# Altium schematic sheet Regulator.SchDoc
size 381 x 203 mm; SheetNumber: 2; SheetTotal: 2; SPICEModelCacheNBKOHBQZ: <root> / <DocumentId>NBKOHBQZ</DocumentId> / </root>
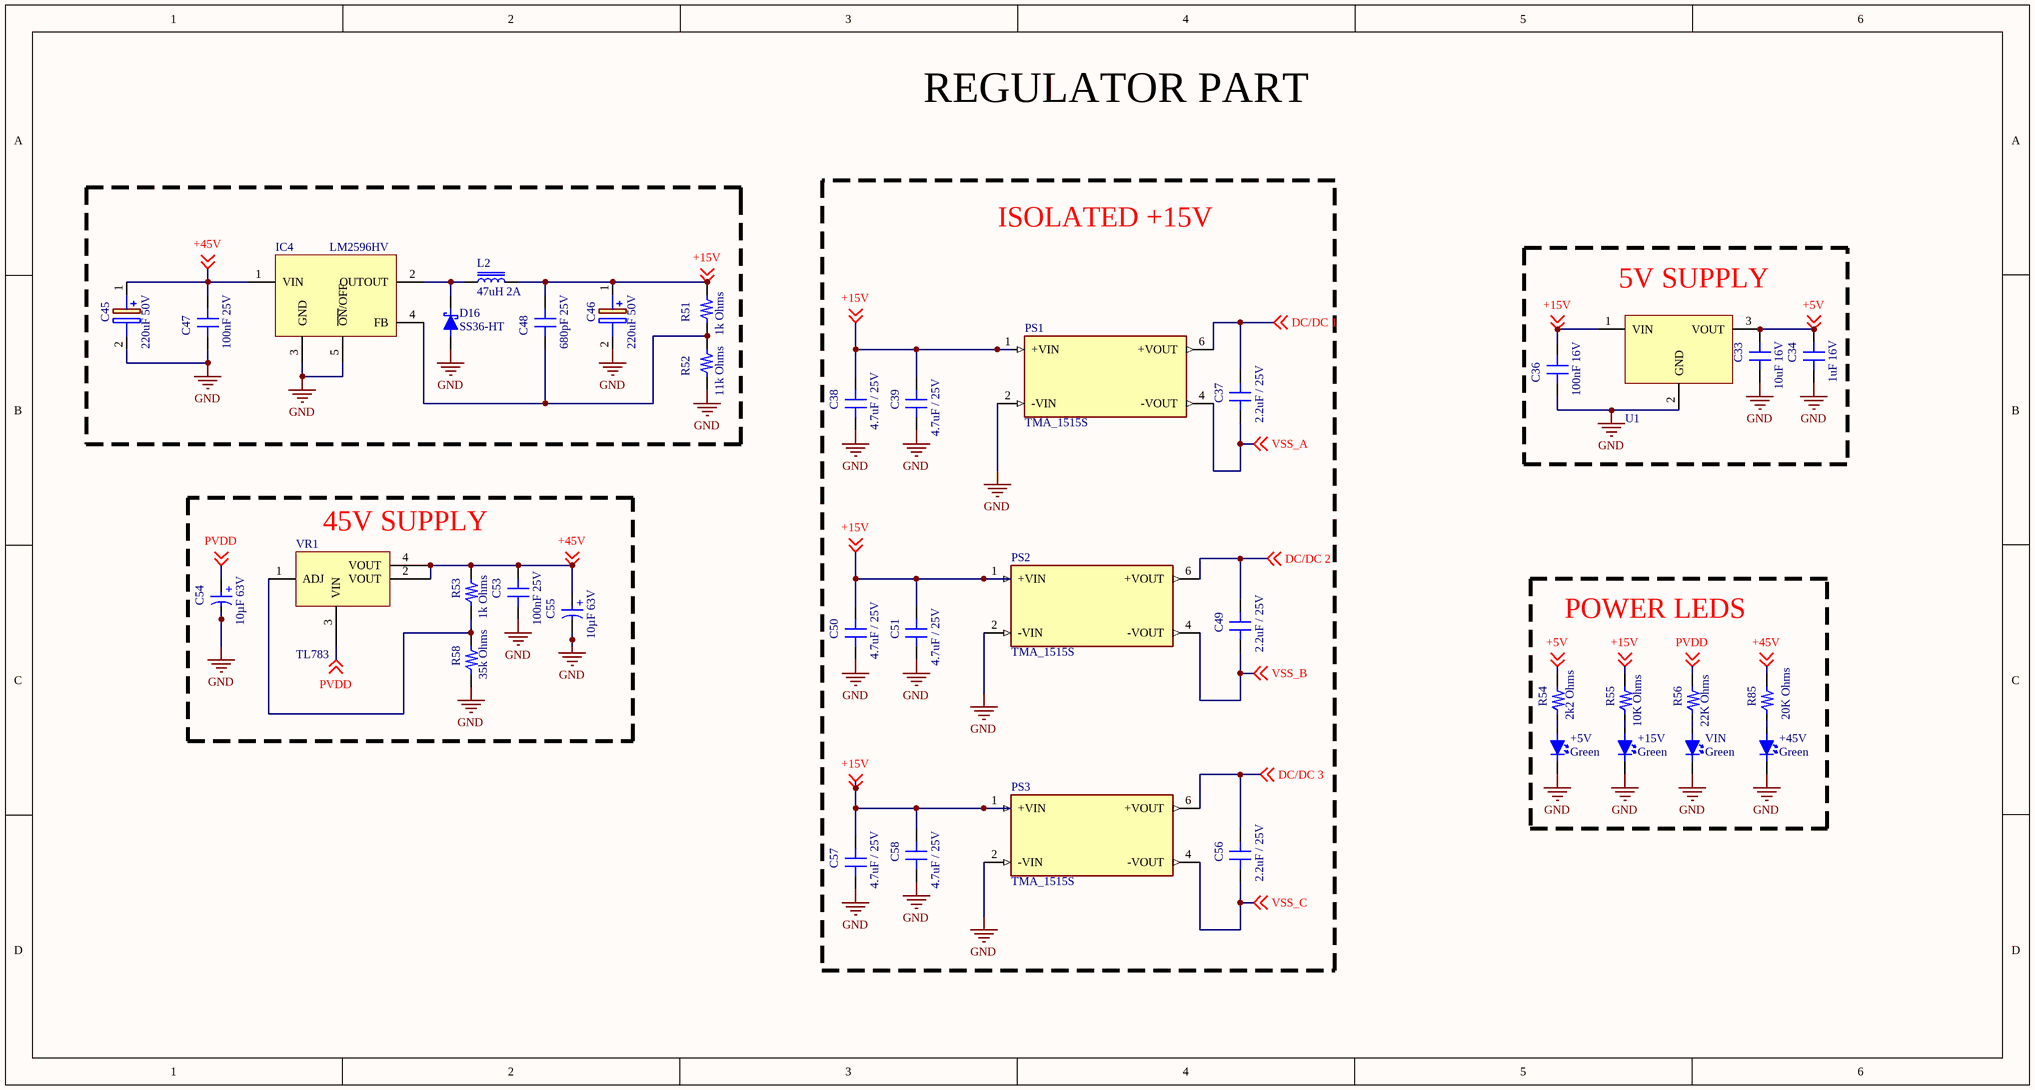
[diagram p0: Regulator.SchDoc]

## Parts
+5V  Green  [0805LED]
+15V  Green  [0805LED]
+45V  Green  [0805LED]
C33  10uF 16V  [0805_CAP]
C34  1uF 16V  [0805_CAP]
C36  100nF 16V  [0805_CAP]
C37  2.2uF / 25V  [0805_CAP]
C38  4.7uF / 25V  [0805_CAP]
C39  4.7uF / 25V  [0805_CAP]
C45  220uF 50V  [CAPAE1030X1060N]
C46  220uF 50V  [CAPAE1030X1060N]
C47  100nF 25V  [0805_CAP]
C48  680pF 25V  [0805_CAP]
C49  2.2uF / 25V  [0805_CAP]
C50  4.7uF / 25V  [0805_CAP]
C51  4.7uF / 25V  [0805_CAP]
C53  100nF 25V  [0805_CAP]
C54  10µF 63V  [WCAP-ATG5_D5H11]
C55  10µF 63V  [WCAP-ATG5_D5H11]
C56  2.2uF / 25V  [0805_CAP]
C57  4.7uF / 25V  [0805_CAP]
C58  4.7uF / 25V  [0805_CAP]
D16  SS36-HT  [DO-214AB]
IC4  LM2596HV  [TO-263-5]
L2  47uH 2A  [BOURNS SRR1280]
PS1  TMA_1515S  [CONV_TMA_1515S]
PS2  TMA_1515S  [CONV_TMA_1515S]
PS3  TMA_1515S  [CONV_TMA_1515S]
R51  1k Ohms  [0805_RES]
R52  11k Ohms  [0805_RES]
R53  1k Ohms  [0805_RES]
R54  2k2 Ohms  [0805_RES]
R55  10K Ohms  [0805_RES]
R56  22K Ohms  [0805_RES]
R58  35k Ohms  [0805_RES]
R85  20K Ohms  [0805_RES]
U1  8-28Vin, 5Vout, 1Aout  [WPME-FDSM_SIP-3_L11.6W8.5H10.5]  (value not drawn)
VIN  Green  [0805LED]
VR1  TL783  [TL783]

## Blocks framed on the sheet
ISOLATED +15V: C37-C39 C49-C51 C56-C58 PS1-PS3
45V SUPPLY: C53-C55 R53 R58 VR1
POWER LEDS: +5V +15V +45V R54-R56 R85 VIN

## Nets
GND: +5V.2(Cathode(-)) +15V.2(Cathode(-)) +45V.2(Cathode(-)) C33.1 C34.1 C36.1 C38.1 C39.1 C45.2(-) C46.2(-) C47.1 C50.1 C51.1 C53.1 C54.2(N) C55.2(N) C57.1 C58.1 D16.1 IC4.3(GND) IC4.5(~{ON}/OFF) PS1.2(-VIN) PS2.2(-VIN) PS3.2(-VIN) R52.1 R58.2 U1.2(GND) VIN.2(Cathode(-))
+5V: C33.2 C34.2 R54.1 U1.3(VOUT) ; off-sheet +5V
+15V: C36.2 C38.2 C39.2 C46.1(+) C48.2 C50.2 C51.2 C57.2 C58.2 L2.2 PS1.1(+VIN) PS2.1(+VIN) PS3.1(+VIN) R51.2 R55.1 U1.1(VIN) ; off-sheet +15V
+45V: C45.1(+) C47.2 C53.2 C55.1(P) IC4.1(VIN) R53.1 R85.1 VR1.2(VOUT) VR1.4(VOUT) ; off-sheet +45V
DC/DC 1: C37.2 PS1.6(+VOUT) ; off-sheet DC/DC 1
DC/DC 2: C49.2 PS2.6(+VOUT) ; off-sheet DC/DC 2
DC/DC 3: C56.2 PS3.6(+VOUT) ; off-sheet DC/DC 3
PVDD: C54.1(P) R56.1 VR1.3(VIN) ; off-sheet PVDD
VSS_A: C37.1 PS1.4(-VOUT) ; off-sheet VSS_A
VSS_B: C49.1 PS2.4(-VOUT) ; off-sheet VSS_B
VSS_C: C56.1 PS3.4(-VOUT) ; off-sheet VSS_C
Net+5V_1: +5V.1(Anode(+)) R54.2
Net+15V_1: +15V.1(Anode(+)) R55.2
Net+45V_1: +45V.1(Anode(+)) R85.2
NetC48_1: C48.1 IC4.4(FB) R51.1 R52.2
NetD16_2: D16.2 IC4.2(OUTOUT) L2.1
NetR53_2: R53.2 R58.1 VR1.1(ADJ)
NetR56_2: R56.2 VIN.1(Anode(+))

## Notes on the sheet
- REGULATOR PART
- (near U1) 5V SUPPLY
- (in symbol 860020772010) +

## Library data of the parts
+5V +15V +45V VIN = LED: 0805
C33 C34 C36 C47 C48 C53 = CAP_0805
  C33: Value: 10uF 16V
  C34: Value: 1uF 16V
  C36: Value: 100nF 16V
  C47 C53: Value: 100nF 25V
  C48: Value: 680pF 25V
C37-C39 C49-C51 C56-C58 = CAP_0805: Value: 100nF 25V
C45 C46 = CK1H221M-CRG10: Capacitor Polarised; Manufacturer_Name: SEMTECH; Datasheet Link: https://datasheet.lcsc.com/szlcsc/1810281207_ST-Semtech-CK1H221M-CRG10_C131159.pdf; Height: 10.6mm; Manufacturer_Part_Number: CK1H221M-CRG10
C54 C55 = 860020772010: WCAP-ATG5 Aluminum Electrolytic Capacitor, Radial, THT, D5 x H11mm, 10µF, 63V; Manufacturer: Wurth Elektronik; Capacitance Tolerance: +/-20%; Dissipation Factor: 9%; Endurance: 2000h; Leakage Current: 6.3µA; Ripple Current: 42mA; Technical Reference: ATDC110100M063DSPA3B000; Manufacturer Part Number: 860020772010; Category: Aluminum Electrolytic Capacitors; Match Code: WCAP-ATG5; ComponentLink1Description: Website Link; ComponentLink1URL: https://www.we-online.com/redexpert/article/860020772010?ad; ComponentLink2Description: Datasheet Link; ComponentLink2URL: https://www.we-online.com/redexpert/spec/860020772010?ad; Mount: Through Hole; Operating Temperature Max: 105°C; Operating Temperature Min: -40°C; Packaging: Ammo Pack; Height: 11mm; Diameter: 5mm; Rated Voltage (DC): 63V; Capacitance: 10µF 63V
D16 = SS36-214AB-HT: Schottky Diode; ComponentLink1Description: Özdisan; ComponentLink1URL: https://ozdisan.com/guc-yari-iletkenleri/diyotlar-modul-diyotlar-ve-dogrultucular/schottky-diyotlar/SS36-214AB-HT/475999; ComponentLink2Description: Datasheet; ComponentLink2URL: https://cdn.ozdisan.com/ETicaret_Dosya/475999_7494647.pdf; PartNumber: SS36-HT
IC4 = LM2596HV: Integrated Circuit; Manufacturer_Name: Texas Instruments; Datasheet Link: http://www.ti.com/lit/ds/symlink/lm2596.pdf; PartValue: LM2596HV; Mouser Part Number: 926-LM2596S-12; Mouser Price/Stock: https://www.mouser.co.uk/ProductDetail/Texas-Instruments/LM2596S-12?qs=X1J7HmVL2ZEK1FPBBSYJCA%3D%3D; Arrow Part Number: LM2596S-12; Arrow Price/Stock: https://www.arrow.com/en/products/lm2596s-12/texas-instruments
L2 = Inductor: FIXED IND 47UH 2.9A 80 MOHM SMD; Value: 47uH 2A
PS1-PS3 = TMA_1515S: MF: {'manufacturer': u'Traco Power'}; Package: None; Price: None; Value: *; MP: TMA_1515S; Availability: Unavailable
R51 = RES_0805: 0805; Value: 11k Ohms; Power: 1/8 W
R52 = RES_0805: 0805; Value: 1k Ohms; Power: 1/8 W
R53-R56 R58 R85 = RES_0805: 0805; Power: 1/8 W
  R53: Value: 1k Ohms
  R54: Value: 2k2 Ohms
  R55: Value: 10K Ohms
  R56: Value: 22K Ohms
  R58: Value: 35k Ohms
  R85: Value: 20K Ohms
U1 = 173010578: WPME-FDSM Fixed Step Down Regulator Module, THT, SIP-3, 8-28Vin, 5Vout, 1Aout; Manufacturer: Wurth Elektronik; Input Voltage Min: 8V; Input Voltage Max: 28V; Output Current: 1A; Output Voltage: 5V; Manufacturer Part Number: 173010578; Category: Step Down Converter; Match Code: WPME-FDSM; ComponentLink1Description: Website Link; ComponentLink1URL: https://www.we-online.com/redexpert/article/173010578?ad; ComponentLink2Description: Datasheet Link; ComponentLink2URL: https://www.we-online.com/redexpert/spec/173010578?ad; Mount: Through Hole; Operating Temperature Max: 85°C; Operating Temperature Min: -40°C; Packaging: Tube; Case/Size Code: SIP-3; Length: 11.6mm; Width: 8.5mm; Height: 10.5mm
VR1 = TL783/SMD